# Altium schematic sheet rv_pwr_addon.SchDoc: RV Essential: Expansion
size A4; DocumentNumber: 1; Revision: A; SheetNumber: 5; SheetTotal: 5
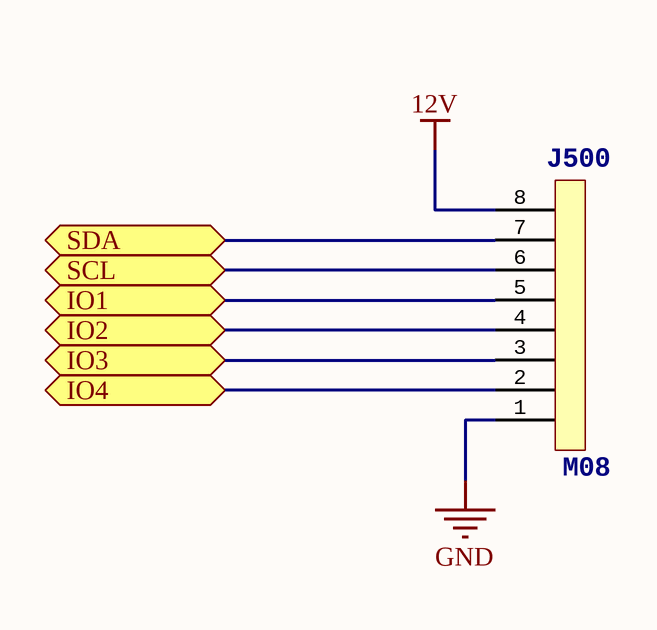
[diagram p0: rv_pwr_addon.SchDoc]

## Parts
J500  M08  [1X08]

## Ports
IO1 (bidir), IO2 (bidir), IO3 (bidir), IO4 (bidir), SCL (bidir), SDA (bidir)

## Nets
12V: J500.8
GND: J500.1
IO1: J500.5 ; port IO1
IO2: J500.4 ; port IO2
IO3: J500.3 ; port IO3
IO4: J500.2 ; port IO4
SCL: J500.6 ; port SCL
SDA: J500.7 ; port SDA

## Notes on the sheet
- Title
- Size:
- Date:
- A4
- Number:
- Time:
- Revision:
- Sheet
- of
- github.com/blueacro
- blueacro.com
- CERN OHL v2.0
- Made available under the
- File:
- © 2023 StackFoundry LLC. All Rights Reserved.

## Library data of the parts
J500 = CMP-166-0002-1: Source: con-headers.SCHLIB; Design Item ID: M08